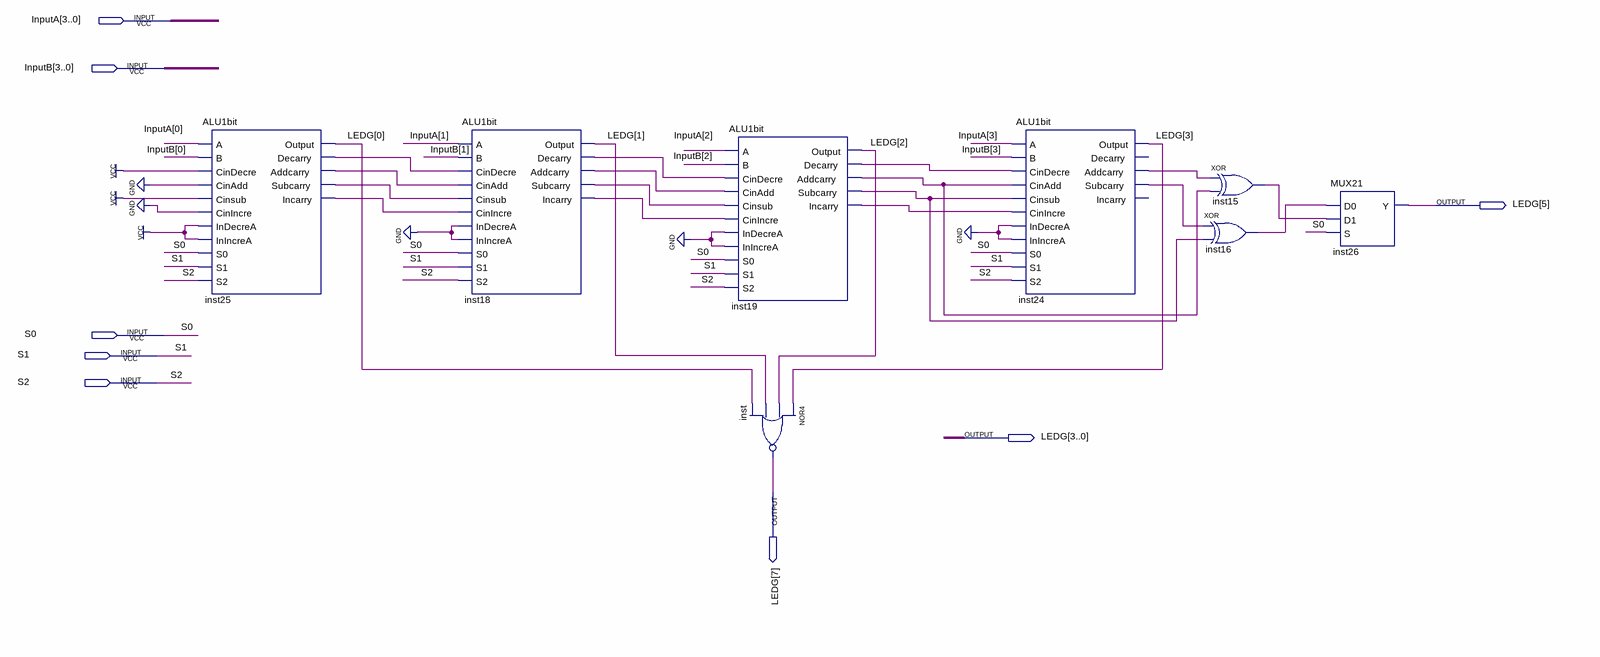
[diagram p0: schematic sheet]
// Quartus schematic ALU4bit.bdf as structural Verilog: 8 symbols, 8 pins
module ALU4bit (
  input  [3:0] InputA,
  input  [3:0] InputB,
  input  S0,
  input  S1,
  input  S2,
  output [7:0] LEDG
);

  wire inst15_out, inst16_out, inst18_addcarry, inst18_decarry, inst18_incarry, inst18_subcarry,
       inst19_addcarry, inst19_decarry, inst19_incarry, inst19_subcarry, inst24_addcarry, inst24_subcarry,
       inst25_addcarry, inst25_decarry, inst25_incarry, inst25_subcarry;

  ALU1bit inst25 (
    .A(InputA[0]), .B(InputB[0]), .CinDecre(1'b1), .CinAdd(1'b0), .Cinsub(1'b1), .CinIncre(1'b0),
    .InDecreA(1'b1), .InIncreA(1'b1), .S0(S0), .S1(S1), .S2(S2), .Output(LEDG[0]), .Decarry(inst25_decarry),
    .Addcarry(inst25_addcarry), .Subcarry(inst25_subcarry), .Incarry(inst25_incarry));
  ALU1bit inst18 (
    .A(InputA[1]), .B(InputB[1]), .CinDecre(inst25_decarry), .CinAdd(inst25_addcarry),
    .Cinsub(inst25_subcarry), .CinIncre(inst25_incarry), .InDecreA(1'b0), .InIncreA(1'b0), .S0(S0), .S1(S1),
    .S2(S2), .Output(LEDG[1]), .Decarry(inst18_decarry), .Addcarry(inst18_addcarry),
    .Subcarry(inst18_subcarry), .Incarry(inst18_incarry));
  ALU1bit inst19 (
    .A(InputA[2]), .B(InputB[2]), .CinDecre(inst18_decarry), .CinAdd(inst18_addcarry),
    .Cinsub(inst18_subcarry), .CinIncre(inst18_incarry), .InDecreA(1'b0), .InIncreA(1'b0), .S0(S0), .S1(S1),
    .S2(S2), .Output(LEDG[2]), .Decarry(inst19_decarry), .Addcarry(inst19_addcarry),
    .Subcarry(inst19_subcarry), .Incarry(inst19_incarry));
  nor inst (LEDG[7], LEDG[3], LEDG[2], LEDG[1], LEDG[0]);
  ALU1bit inst24 (
    .A(InputA[3]), .B(InputB[3]), .CinDecre(inst19_decarry), .CinAdd(inst19_addcarry),
    .Cinsub(inst19_subcarry), .CinIncre(inst19_incarry), .InDecreA(1'b0), .InIncreA(1'b0), .S0(S0), .S1(S1),
    .S2(S2), .Output(LEDG[3]), .Addcarry(inst24_addcarry), .Subcarry(inst24_subcarry));  // open: Decarry, Incarry
  xor inst15 (inst15_out, inst24_addcarry, inst19_addcarry);
  xor inst16 (inst16_out, inst24_subcarry, inst19_subcarry);
  MUX21 inst26 (.D0(inst16_out), .D1(inst15_out), .S(S0), .Y(LEDG[5]));
endmodule
